# Altium schematic sheet TFT.SchDoc
size A; SheetNumber: 0; SheetTotal: 0
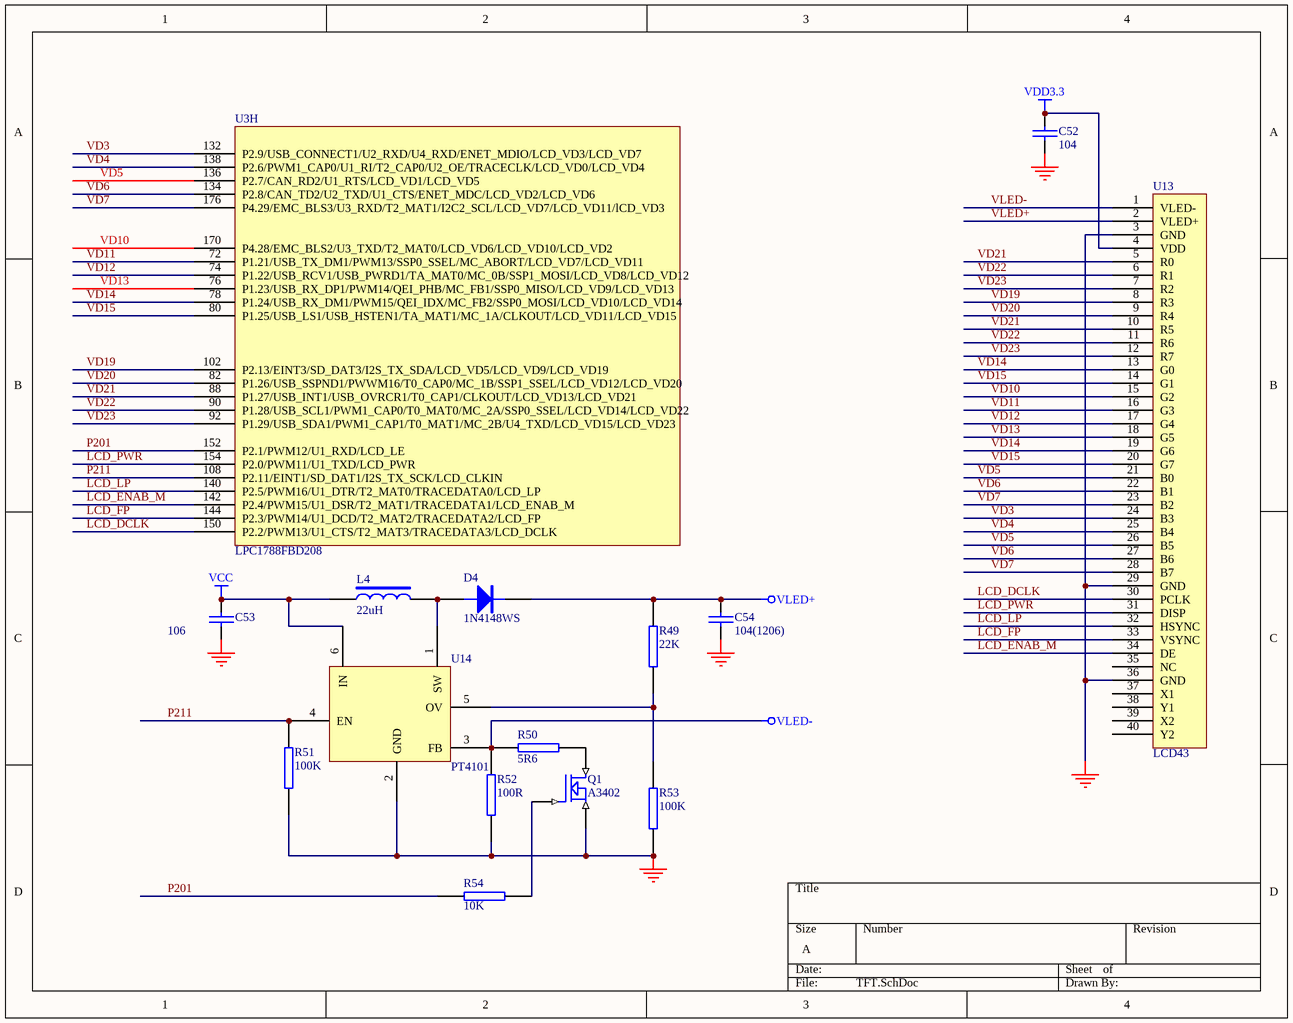
[diagram p0: TFT.SchDoc]

## Parts
C52  104  [C0603]
C53  106  [C0805]
C54  104(1206)  [C1206]
D4  1N4148WS  [SOD323]
L4  22uH  [L4X4]
Q1  A3402  [SOT23_9013]
R49  22K  [R0603]
R50  5R6  [R0603]
R51  100K  [R0603]
R52  100R  [R0603]
R53  100K  [R0603]
R54  10K  [R0603]
U3  LPC1788FBD208  [QFP208]  (part H of 8)
U13  LCD43  [SMTSOFT40]
U14  PT4101  [SOT23-6]

## Nets
GND: C52.2 C53.2 C54.2 Q1.3(S) R51.2 R52.2 R53.1 U13.3(GND) U13.29(GND) U13.36(GND) U14.2(GND)
VCC: C53.1 L4.1 U14.6(IN)
VDD3.3: C52.1 U13.4(VDD)
VLED+: C54.1 D4.2(K) R49.2 U13.2(VLED+)
VLED-: R50.2 R52.1 U13.1(VLED-) U14.3(FB)
LCD_DCLK: U3.150(P2.2/PWM13/U1_CTS/T2_MAT3/TRACEDATA3/LCD_DCLK) U13.30(PCLK)
LCD_ENAB_M: U3.142(P2.4/PWM15/U1_DSR/T2_MAT1/TRACEDATA1/LCD_ENAB_M) U13.34(DE)
LCD_FP: U3.144(P2.3/PWM14/U1_DCD/T2_MAT2/TRACEDATA2/LCD_FP) U13.33(VSYNC)
LCD_LP: U3.140(P2.5/PWM16/U1_DTR/T2_MAT0/TRACEDATA0/LCD_LP) U13.32(HSYNC)
LCD_PWR: U3.154(P2.0/PWM11/U1_TXD/LCD_PWR) U13.31(DISP)
P201: R54.1 U3.152(P2.1/PWM12/U1_RXD/LCD_LE)
P211: R51.1 U3.108(P2.11/EINT1/SD_DAT1/I2S_TX_SCK/LCD_CLKIN) U14.4(EN)
VD3: U3.132(P2.9/USB_CONNECT1/U2_RXD/U4_RXD/ENET_MDIO/LCD_VD3/LCD_VD7) U13.24(B3)
VD4: U3.138(P2.6/PWM1_CAP0/U1_RI/T2_CAP0/U2_OE/TRACECLK/LCD_VD0/LCD_VD4) U13.25(B4)
VD5: U3.136(P2.7/CAN_RD2/U1_RTS/LCD_VD1/LCD_VD5) U13.21(B0) U13.26(B5)
VD6: U3.134(P2.8/CAN_TD2/U2_TXD/U1_CTS/ENET_MDC/LCD_VD2/LCD_VD6) U13.22(B1) U13.27(B6)
VD7: U3.176(P4.29/EMC_BLS3/U3_RXD/T2_MAT1/I2C2_SCL/LCD_VD7/LCD_VD11/lCD_VD3) U13.23(B2) U13.28(B7)
VD10: U3.170(P4.28/EMC_BLS2/U3_TXD/T2_MAT0/LCD_VD6/LCD_VD10/LCD_VD2) U13.15(G2)
VD11: U3.72(P1.21/USB_TX_DM1/PWM13/SSP0_SSEL/MC_ABORT/LCD_VD7/LCD_VD11) U13.16(G3)
VD12: U3.74(P1.22/USB_RCV1/USB_PWRD1/TA_MAT0/MC_0B/SSP1_MOSI/LCD_VD8/LCD_VD12) U13.17(G4)
VD13: U3.76(P1.23/USB_RX_DP1/PWM14/QEI_PHB/MC_FB1/SSP0_MISO/LCD_VD9/LCD_VD13) U13.18(G5)
VD14: U3.78(P1.24/USB_RX_DM1/PWM15/QEI_IDX/MC_FB2/SSP0_MOSI/LCD_VD10/LCD_VD14) U13.13(G0) U13.19(G6)
VD15: U3.80(P1.25/USB_LS1/USB_HSTEN1/TA_MAT1/MC_1A/CLKOUT/LCD_VD11/LCD_VD15) U13.14(G1) U13.20(G7)
VD19: U3.102(P2.13/EINT3/SD_DAT3/I2S_TX_SDA/LCD_VD5/LCD_VD9/LCD_VD19) U13.8(R3)
VD20: U3.82(P1.26/USB_SSPND1/PWWM16/T0_CAP0/MC_1B/SSP1_SSEL/LCD_VD12/LCD_VD20) U13.9(R4)
VD21: U3.88(P1.27/USB_INT1/USB_OVRCR1/T0_CAP1/CLKOUT/LCD_VD13/LCD_VD21) U13.5(R0) U13.10(R5)
VD22: U3.90(P1.28/USB_SCL1/PWM1_CAP0/T0_MAT0/MC_2A/SSP0_SSEL/LCD_VD14/LCD_VD22) U13.6(R1) U13.11(R6)
VD23: U3.92(P1.29/USB_SDA1/PWM1_CAP1/T0_MAT1/MC_2B/U4_TXD/LCD_VD15/LCD_VD23) U13.7(R2) U13.12(R7)
NetD4_1: D4.1(A) L4.2 U14.1(SW)
NetQ1_1: Q1.1(G) R54.2
NetQ1_2: Q1.2(D) R50.1
NetR49_1: R49.1 R53.2 U14.5(OV)

Not connected (* = marked no-connect by the designer): U13 35(NC) 37(X1) 38(Y1) 39(X2) 40(Y2)

## Library data of the parts
C52-C54 = CAP: Capacitor
D4 = DIODE
L4 = INDUCTOR2
Q1 = MOSFET N
R49-R54 = RES2